# EAGLE design Pendulum Lamp PCB (EAGLE 8.6.3)
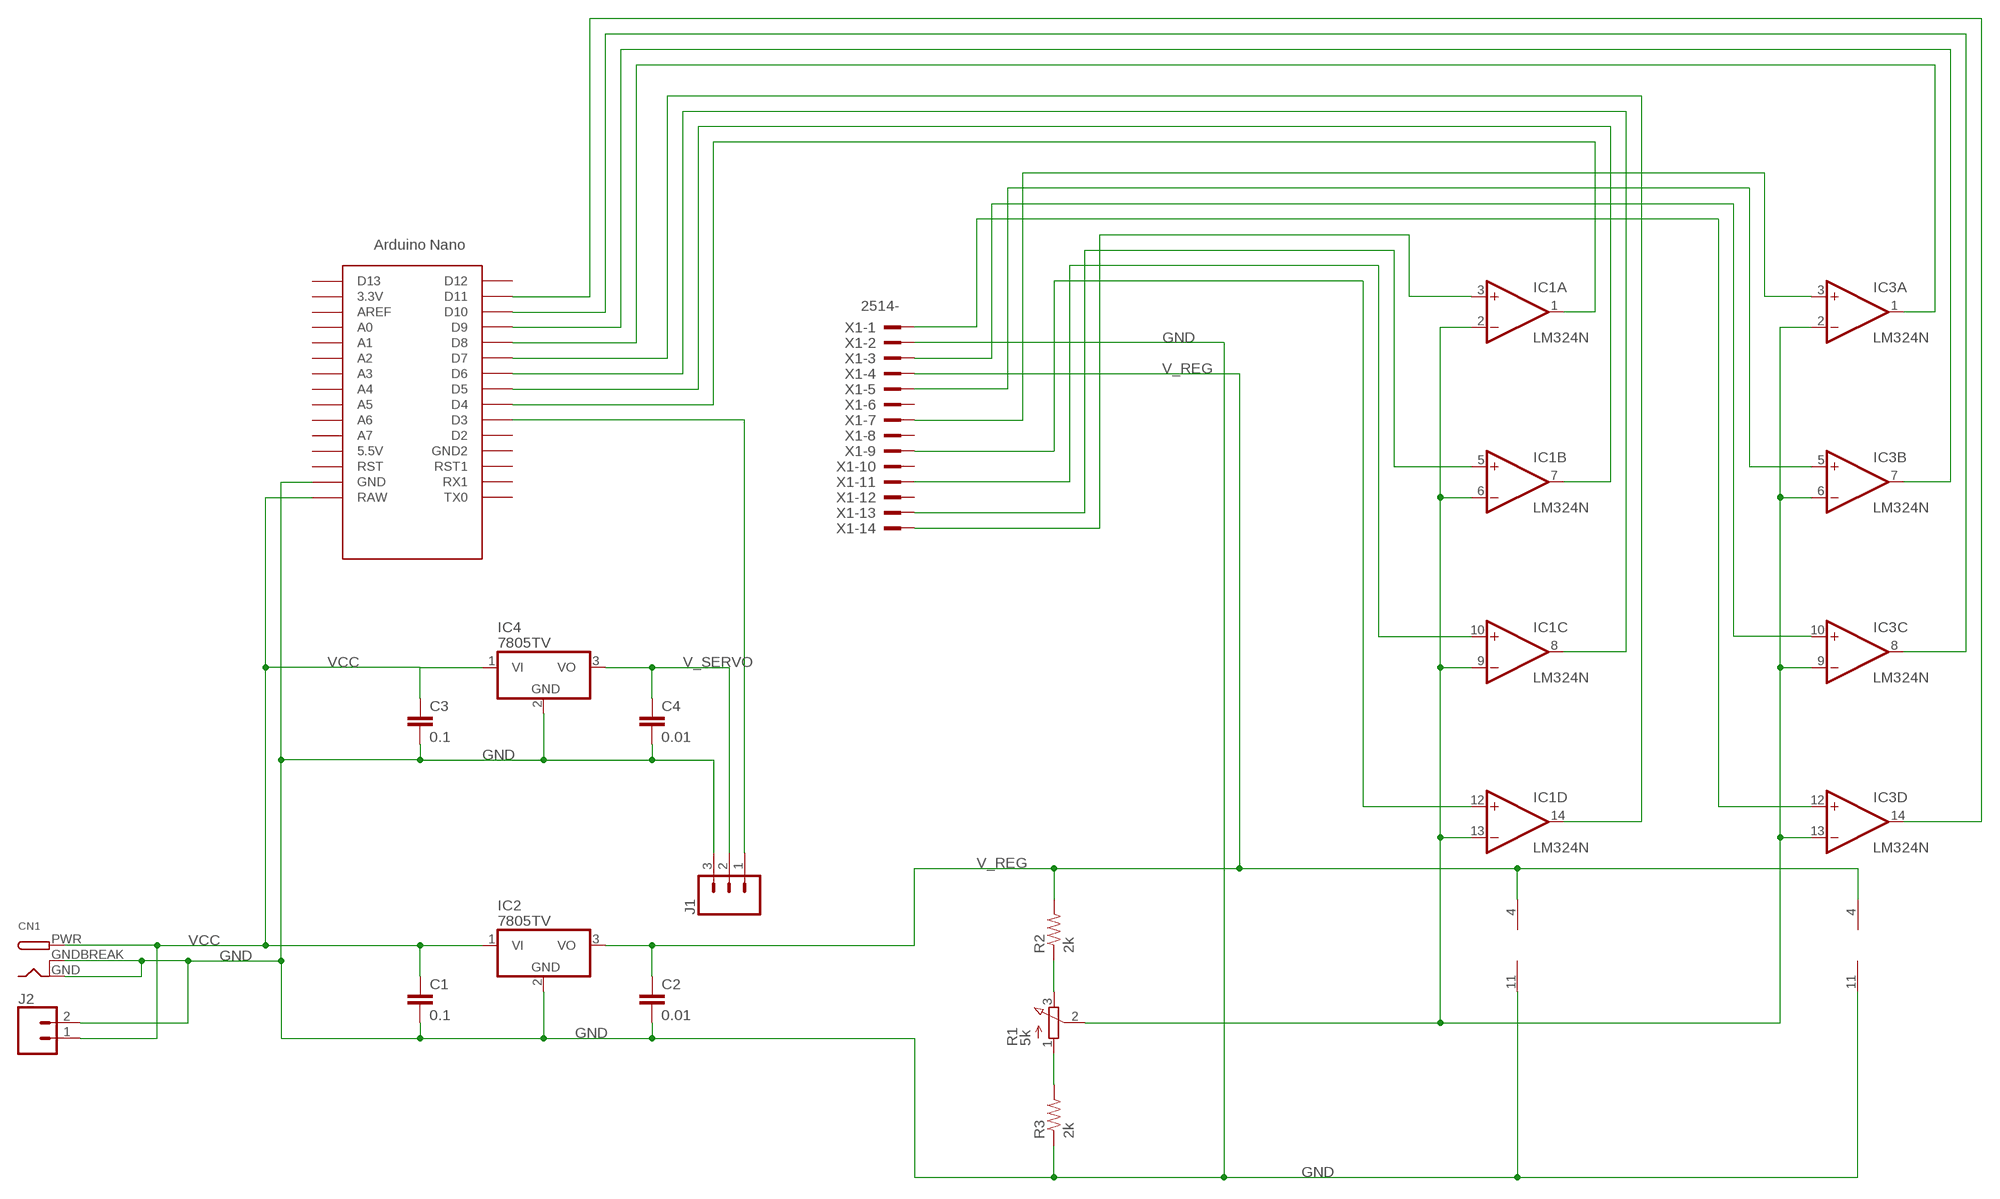
[diagram p0: schematic, sheet 1]

## Parts
C1  0.1  C-EU025-030X050  [C025-030X050]
C2  0.01  C-EU025-030X050  [C025-030X050]
C3  0.1  C-EU025-030X050  [C025-030X050]
C4  0.01  C-EU025-030X050  [C025-030X050]
CN1  DCBARRELPTH  [DCJACK_2MM_PTH]
IC1  LM324N  [DIL14]
IC2  7805TV  [TO220V]
IC3  LM324N  [DIL14]
IC4  7805TV  [TO220V]
J1  CONN_03LONGPADS  [1X03_LONGPADS]
J2  CONN_023.5MM_LOCK  [SCREWTERMINAL-3.5MM-2_LOCK]
R1  5k  3RP/1610N  [3RP/1610N]
R2  2k  R-US_0204/7  [0204/7]
R3  2k  R-US_0204/7  [0204/7]
U$1  NANO  [NANO]
X1  2514-  [PAK100/2500-14]

## Nets
GND: C1.2 C2.2 C3.2 C4.2 CN1.GND CN1.GNDBREAK IC1.11(P:V-) IC2.2(GND) IC3.11(P:V-) IC4.2(GND) J1.3 J2.2 R3.1 U$1.GND X1.2
N$1: IC1.3(A:+IN) X1.14
N$2: IC3.5(B:+IN) X1.5
N$3: J1.1 U$1.D3
N$4: IC3.10(C:+IN) X1.3
N$5: R1.1(A) R3.2
N$6: R1.3(E) R2.1
N$7: IC1.2(A:-IN) IC1.6(B:-IN) IC1.9(C:-IN) IC1.13(D:-IN) IC3.2(A:-IN) IC3.6(B:-IN) IC3.9(C:-IN) IC3.13(D:-IN) R1.2(S)
N$8: IC1.1(A:OUT) U$1.D4
N$9: IC1.7(B:OUT) U$1.D5
N$10: IC1.8(C:OUT) U$1.D6
N$11: IC1.14(D:OUT) U$1.D7
N$12: IC3.1(A:OUT) U$1.D8
N$13: IC3.7(B:OUT) U$1.D9
N$14: IC3.8(C:OUT) U$1.D10
N$15: IC3.14(D:OUT) U$1.D11
N$16: IC3.12(D:+IN) X1.1
N$17: IC1.12(D:+IN) X1.9
N$18: IC1.5(B:+IN) X1.13
N$19: IC1.10(C:+IN) X1.11
N$21: IC3.3(A:+IN) X1.7
V_REG: C2.1 IC1.4(P:V+) IC2.3(VO) IC3.4(P:V+) R2.2 X1.4
V_SERVO: C4.1 IC4.3(VO) J1.2
VCC: C1.1 C3.1 CN1.PWR IC2.1(VI) IC4.1(VI) J2.1 U$1.RAW
Unconnected: U$1.3.3V U$1.5V(5.5V) U$1.A0 U$1.A1 U$1.A2 U$1.A3 U$1.A4 U$1.A5 U$1.A6 U$1.A7 U$1.AREF U$1.D2 U$1.D12 U$1.D13 U$1.GND1(GND2) U$1.ICSP1 U$1.ICSP2 U$1.ICSP3 U$1.ICSP4 U$1.ICSP5 U$1.ICSP6 U$1.RST U$1.RST1 U$1.RX1 U$1.TX0 X1.6 X1.8 X1.10 X1.12

## Library data of the parts
C1-C4 = rcl:C-EU: CAPACITOR, European symbol; SPICEPREFIX: C
CN1 = adafruit:DCBARREL: 2.0mm DC Barrel Jack DCJACK_2MM_PTH - Through Hole Jack (4UConnector: 05537)
IC1 IC3 = linear:LM324: OP AMP
IC2 IC4 = linear:78*: Positive VOLTAGE REGULATOR Source: http://cache.national.com/ds/LM/LM78L05.pdf http://www.fairchildsemi.com/ds/LM/LM7805.pdf
J1 = SparkFun-Connectors:CONN_03: Multi connection point. Often used as Generic Header-pin footprint for 0.1 inch spaced/style header connections On any of the 0.1 inch spaced packages, you can populate with these: Break Away Headers - Straight <https://www.sparkfun.com/products/116> (PRT-00116) Break Away Male Headers - Right Angle <https://www.sparkfun.com/products/553> (PRT-00553) Female Headers <https://www.sparkfun.com/products/115> (PRT-00115) Break Away Headers - Machine Pin <https://www.sparkfun.com/products/117> (PRT-00117) Break Away Female Headers - Swiss Machine Pin <https://www.sparkfun.com/products/743> (PRT-00743) Stackable Header - 3 Pin (Female, 0.1") <https://www.sparkfun.com/products/13875> (PRT-13875) For SCREWTERMINALS and SPRING TERMINALS visit here: Screw Terimnals on SparkFun.com <https://www.sparkfun.com/search/results?term=Screw+Terminals> (5mm/3.5mm/2.54mm spacing) This device is also useful as a general connection point to wire up your design to another part of your project. Our various solder wires solder well into these plated through hole pads. Hook-Up Wire - Assortment (Stranded, 22 AWG) <https://www.sparkfun.com/products/11375> (PRT-11375) Hook-Up Wire - Assortment (Solid Core, 22 AWG) <https://www.sparkfun.com/products/11367> (PRT-11367) View the entire wire category on our website here <https://www.sparkfun.com/categories/141> Special notes: Molex polarized connector foot print use with SKU : PRT-08232 with associated crimp pins and housings.
J2 = SparkFun-Connectors:CONN_02: Multi connection point. Often used as Generic Header-pin footprint for 0.1 inch spaced/style header connections On any of the 0.1 inch spaced packages, you can populate with these: Break Away Headers - Straight <https://www.sparkfun.com/products/116> (PRT-00116) Break Away Male Headers - Right Angle <https://www.sparkfun.com/products/553> (PRT-00553) Female Headers <https://www.sparkfun.com/products/115> (PRT-00115) Break Away Headers - Machine Pin <https://www.sparkfun.com/products/117> (PRT-00117) Break Away Female Headers - Swiss Machine Pin <https://www.sparkfun.com/products/743> (PRT-00743) For SCREWTERMINALS and SPRING TERMINALS visit here: Screw Terimnals on SparkFun.com <https://www.sparkfun.com/search/results?term=Screw+Terminals> (5mm/3.5mm/2.54mm spacing) This device is also useful as a general connection point to wire up your design to another part of your project. Our various solder wires solder well into these plated through hole pads. Hook-Up Wire - Assortment (Stranded, 22 AWG) <https://www.sparkfun.com/products/11375> (PRT-11375) Hook-Up Wire - Assortment (Solid Core, 22 AWG) <https://www.sparkfun.com/products/11367> (PRT-11367) View the entire wire category on our website here <https://www.sparkfun.com/categories/141> Special notes: Molex polarized connector foot print use with: PRT-08233 with associated crimp pins and housings. 2.54_SCREWTERM for use with PRT-10571. 3.5mm Screw Terminal footprints for PRT-08084 5mm Screw Terminal footprints for use with PRT-08432; PROD_ID: CONN-08399
R1 = pot:3RP/1610N: 16mm Potentiometer one level Source: http://www.alphapotentiometers.net/html/16mm_pot_2.html
R2 R3 = rcl:R-US_: RESISTOR, American symbol; SPICEPREFIX: R
U$1 = Arduino-clone:NANO: Arduino Nano
X1 = con-3m:2514-: 3M (TM) Pak 100 4-Wall Header Source: 3M; OC_FARNELL: unknown; OC_NEWARK: unknown

## Board
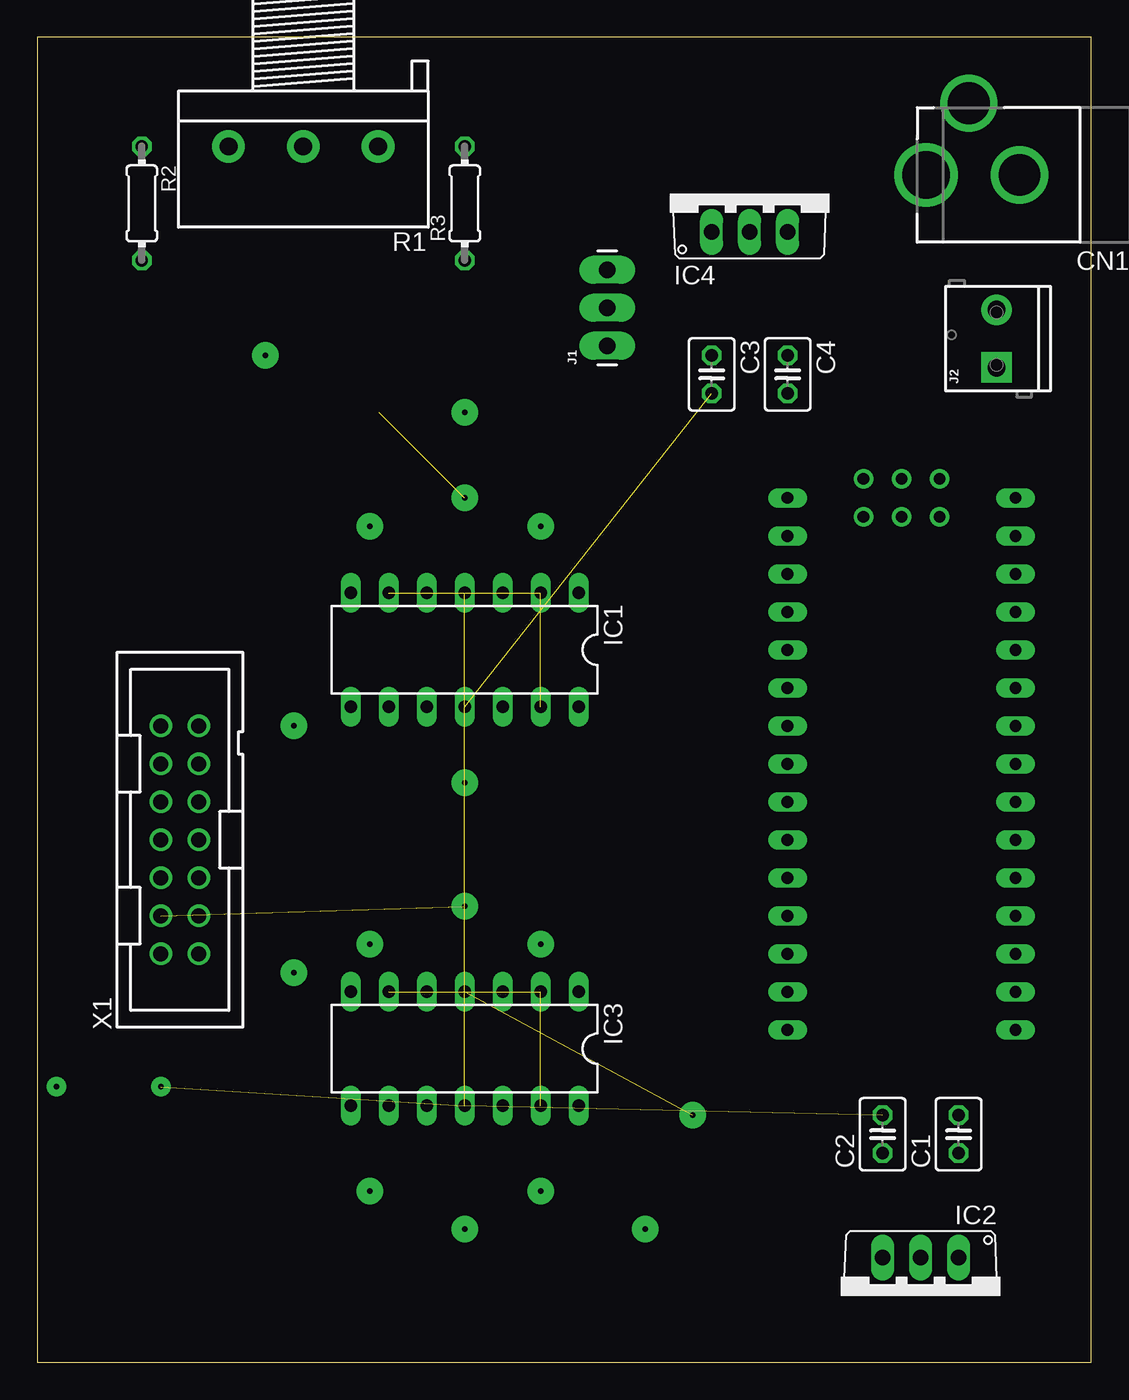
[diagram p1: board, top side]
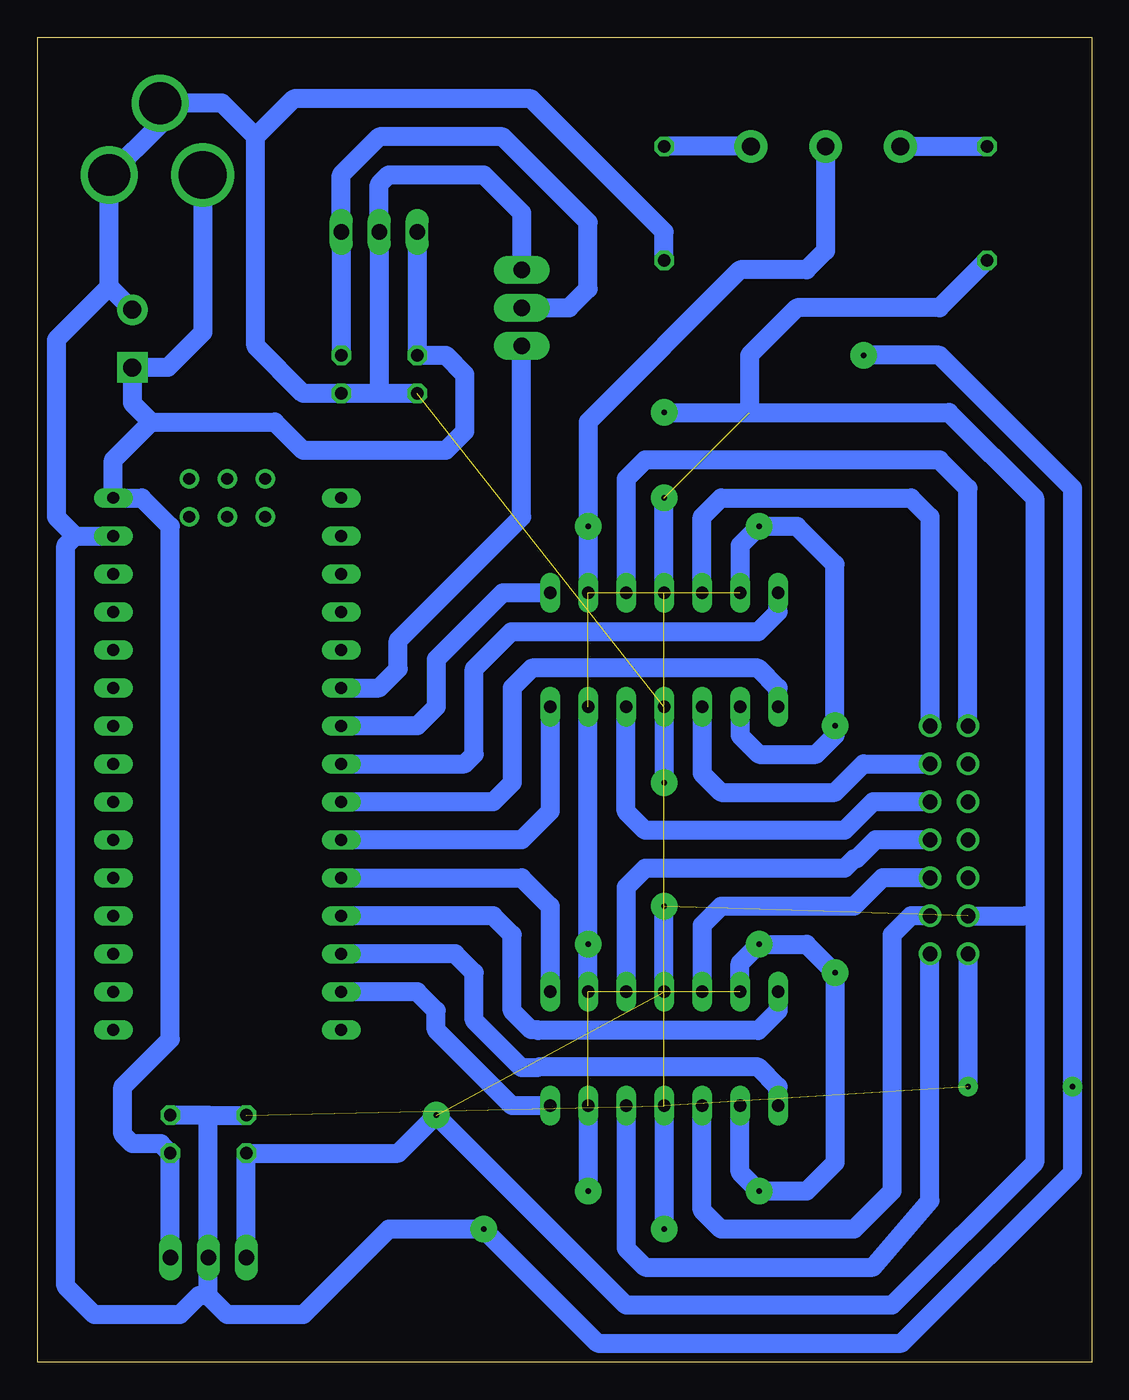
[diagram p2: board, bottom side, seen from below]

Size 70.47 x 88.57 mm. Coordinates in mm from the lower left corner, seen from the top.
Outline: 0,0 70.47,0 70.47,88.57 0,88.57 0,0
Copper layers (1*16): Top 0.035mm / dielectric 1.5mm / Bottom 0.035mm
Design rules "default *": minimum track width 6mil, minimum drill 0.35mm, track to track 15mil, track to pad 15mil, pad to pad 15mil, via to via 15mil, smd to smd 15mil, copper to edge 40mil, drill to drill 6mil, minimum pad ring 10mil, minimum via ring 8mil, stop-mask expansion 4mil, vias tented up to drill 0mil, thermal gap 10mil

### Footprints (pad centres in the part's own frame; a part is rotated, then mirrored left to right if it is on the bottom)
C025-030X050 = drill 0.813 octagon: 1 -1.27,0; 2 1.27,0
DCJACK_2MM_PTH = drill 2.8: GND 0,7.35; GNDBREAK 4.8,10.75 | drill 3.2: PWR 0,13.6
DIL14 = drill 0.813 long: 1 -7.62,-3.81; 2 -5.08,-3.81; 3 -2.54,-3.81; 4 0,-3.81; 5 2.54,-3.81; 6 5.08,-3.81; 7 7.62,-3.81; 8 7.62,3.81; 9 5.08,3.81; 10 2.54,3.81; 11 0,3.81; 12 -2.54,3.81; 13 -5.08,3.81; 14 -7.62,3.81
TO220V = drill 1.016 long: 1 -2.54,-2.54; 2 0,-2.54; 3 2.54,-2.54
1X03_LONGPADS = drill 1.118 pad 1.88 long: 1 0,0; 2 2.54,0; 3 5.08,0
SCREWTERMINAL-3.5MM-2_LOCK = drill 1.2 pad 2.032 square: 1 -0.178,0 | drill 1.2 pad 2.032: 2 3.678,0
3RP/1610N = drill 1.2 pad 2.184: 1 -5,0; 2 0,0; 3 5,0
0204/7 = drill 0.813 octagon: 1 -3.81,0; 2 3.81,0
NANO = drill 0.8 long: 3.3V -10.16,24.13; 5V -10.16,-1.27; A0 -10.16,19.05; A1 -10.16,16.51; A2 -10.16,13.97; A3 -10.16,11.43; A4 -10.16,8.89; A5 -10.16,6.35; A6 -10.16,3.81; A7 -10.16,1.27; AREF -10.16,21.59; D2 5.08,1.27; D3 5.08,3.81; D4 5.08,6.35; D5 5.08,8.89; D6 5.08,11.43; D7 5.08,13.97; D8 5.08,16.51; D9 5.08,19.05; D10 5.08,21.59; D11 5.08,24.13; D12 5.08,26.67; D13 -10.16,26.67; GND -10.16,-6.35; GND1 5.08,-1.27; RAW -10.16,-8.89; RST -10.16,-3.81; RST1 5.08,-3.81; RX1 5.08,-6.35; TX0 5.08,-8.89 | drill 0.8: ICSP1 -5.08,-10.16; ICSP2 -5.08,-7.62; ICSP3 -2.54,-10.16; ICSP4 -2.54,-7.62; ICSP5 0,-10.16; ICSP6 0,-7.62
PAK100/2500-14 = drill 1 pad 1.422: 1 -7.62,-1.27; 2 -7.62,1.27; 3 -5.08,-1.27; 4 -5.08,1.27; 5 -2.54,-1.27; 6 -2.54,1.27; 7 0,-1.27; 8 0,1.27; 9 2.54,-1.27; 10 2.54,1.27; 11 5.08,-1.27; 12 5.08,1.27; 13 7.62,-1.27; 14 7.62,1.27

### Placement (x,y rotation side)
C1  61.59,15.24 90 top
C2  56.52,15.24 90 top
C3  45.09,66.04 270 top
C4  50.16,66.04 270 top
CN1  73.03,79.38 90 top
IC1  28.57,47.62 180 top
IC2  59.05,4.45 180 top
IC3  28.57,20.95 180 top
IC4  47.62,78.11 0 top
J1  38.1,67.94 90 top
J2  64.14,66.67 90 top
R1  17.78,81.28 180 top
R2  6.99,77.47 270 top
R3  28.57,77.47 90 top
U$1  55.24,48.9 180 top
X1  9.53,34.92 90 top

### Tracks (layer width: path | path; a pad name or v marks a point on that pad's centre or on a via)
GND  (via drill 0.35 pad 1.3, 0.35 pad 1.78)  (4 unrouted)
  Bottom 1.27: C3.2 47.62,64.77 | 47.62,64.77 C4.2 52.7,64.77 55.88,67.94 55.88,81.92 | 47.62,64.77 IC4.2 47.62,78.74 46.99,79.38 40.64,79.38 38.1,76.83 J1.3 | J2.2 65.67,71.89 | 65.67,71.89 CN1.GND 62.27,82.78 CN1.GNDBREAK 58.14,84.17 55.88,81.92 | U$1.GND 67.94,55.24 69.22,56.52 69.22,68.35 65.67,71.89 | IC2.2 59.05,16.51 | 59.05,16.51 C1.2 | 59.05,16.51 C2.2 | IC3.11 28.57,8.89 | IC1.11 v28.57,38.73 | R3.1 28.57,75.56 37.47,84.45 53.34,84.45 55.88,81.92 | X1.2 v8.26,18.41
N$1
  Bottom 1.27: X1.14 8.26,58.42 10.16,60.33 29.84,60.33 31.11,59.05 IC1.3
N$2
  Bottom 1.27: IC3.5 26.04,29.21 24.77,30.48 15.88,30.48 13.97,32.38 X1.5
N$3
  Bottom 1.27: J1.1 38.1,56.52 46.35,48.26 46.35,46.35 47.62,45.09 U$1.D3
N$4
  Bottom 1.27: X1.3 12.06,29.84 13.34,28.57 13.34,11.43 15.88,8.89 24.77,8.89 26.04,10.16 IC3.10
N$5
  Bottom 1.27: R1.1 R3.2
N$6
  Bottom 1.27: R1.3 R2.1
N$7  (via drill 0.35 pad 1.78)  (4 unrouted)
  Bottom 1.27: IC3.2 v33.66,27.94 IC1.13 | IC3.6 23.5,26.67 v22.23,27.94 19.05,27.94 v17.14,26.04 17.14,13.34 19.05,11.43 v22.23,11.43 23.5,12.7 IC3.9 | IC1.9 23.5,41.91 22.23,40.64 18.41,40.64 17.14,41.91 v17.14,42.55 17.14,53.34 19.68,55.88 v22.23,55.88 23.5,54.61 IC1.6 | IC3.13 33.66,11.43 | R1.2 17.78,74.3 19.05,73.03 23.5,73.03 33.66,62.87 IC1.2
N$8
  Bottom 1.27: U$1.D4 45.09,42.55 43.81,43.81 43.81,46.99 39.37,51.44 IC1.1
N$9
  Bottom 1.27: U$1.D5 41.91,40.01 41.27,40.64 41.27,46.35 38.79,48.84 22.28,48.84 20.95,50.16 IC1.7
N$10
  Bottom 1.27: IC1.8 20.95,45.09 22.28,46.41 37.41,46.41 38.73,45.09 38.73,38.73 40.01,37.47 U$1.D6
N$11
  Bottom 1.27: IC1.14 36.2,36.83 38.1,34.92 U$1.D7
N$12
  Bottom 1.27: IC3.1 36.2,30.48 38.1,32.38 U$1.D8
N$13
  Bottom 1.27: U$1.D9 40.01,29.84 38.73,28.57 38.73,23.5 37.47,22.23 37.05,22.23 36.99,22.17 22.28,22.17 20.95,23.5 IC3.7
N$14
  Bottom 1.27: IC3.8 20.95,18.41 22.28,19.74 36.99,19.74 37.05,19.68 38.1,19.68 41.27,22.86 41.27,26.04 42.55,27.3 U$1.D10
N$15
  Bottom 1.27: IC3.14 38.73,17.14 43.81,22.23 43.81,23.5 45.09,24.77 U$1.D11
N$16
  Bottom 1.27: X1.1 10.79,10.79 14.61,6.35 29.84,6.35 31.11,7.62 IC3.12
N$17
  Bottom 1.27: IC1.12 31.11,36.83 29.84,35.56 16.51,35.56 14.61,37.47 X1.9
N$18
  Bottom 1.27: IC1.5 26.04,56.52 24.77,57.78 12.06,57.78 10.79,56.52 X1.13
N$19
  Bottom 1.27: IC1.10 26.04,39.37 24.77,38.1 17.14,38.1 15.24,40.01 X1.11
N$20  (via drill 0.35 pad 1.78)
  other vias: 33.66,55.88
N$21
  Bottom 1.27: X1.7 14.45,34.92 15.72,33.66 15.88,33.66 16.51,33.02 29.84,33.02 31.11,31.75 IC3.3
N$22  (via drill 0.35 pad 1.78)
  other vias: 33.66,11.43
N$23  (via drill 0.35 pad 1.78)
  other vias: 28.57,30.48
N$24  (via drill 0.35 pad 1.78)
  other vias: 28.57,8.89
N$25  (via drill 0.35 pad 1.3, 0.35 pad 1.78)
  Bottom 1.27: 59.05,4.45 57.78,3.17 52.7,3.17 46.99,8.89 v40.64,8.89 33.02,1.27 12.7,1.27 1.27,12.7 v1.27,18.41 1.27,58.42 10.16,67.31 15.24,67.31 | 59.05,4.45 59.05,6.99 | 59.05,4.45 59.69,4.45 60.96,3.17 66.67,3.17 68.58,5.08 68.58,54.61 67.94,55.24
N$26  (via drill 0.35 pad 1.78)
  other vias: 43.81,16.51
N$27  (via drill 0.35 pad 1.78)
  other vias: 28.57,57.78
N$28  (via drill 0.35 pad 1.78)
  Bottom 1.27: v28.57,63.5 9.53,63.5 3.81,57.78 3.81,13.34 13.34,3.81 31.11,3.81 43.81,16.51
N$29  (via drill 0.35 pad 1.78)
  other vias: 15.24,67.31
V_REG  (4 unrouted)
  Bottom 1.27: IC2.3 C2.1 46.35,13.97 43.81,16.51 | IC3.4 28.57,30.48 | IC1.4 28.57,57.78 | R2.2 10.16,70.48 19.68,70.48 22.86,67.31 22.86,63.5 | X1.4 4.45,29.84
V_SERVO
  Bottom 1.27: C4.1 IC4.3 50.16,79.38 47.62,81.92 39.37,81.92 33.66,76.2 33.66,71.75 34.92,70.48 J1.2
VCC
  Bottom 1.27: IC4.1 C3.1 43.18,67.31 41.91,66.04 41.91,62.23 43.18,60.96 52.7,60.96 54.61,62.87 62.87,62.87 | 62.87,62.87 65.41,60.33 U$1.RAW 63.5,57.78 61.59,55.88 61.59,21.59 64.77,18.41 64.77,15.24 64.14,14.61 62.23,14.61 C1.1 IC2.1 | 62.87,62.87 64.14,64.14 J2.1 61.77,66.5 59.42,68.84 CN1.PWR